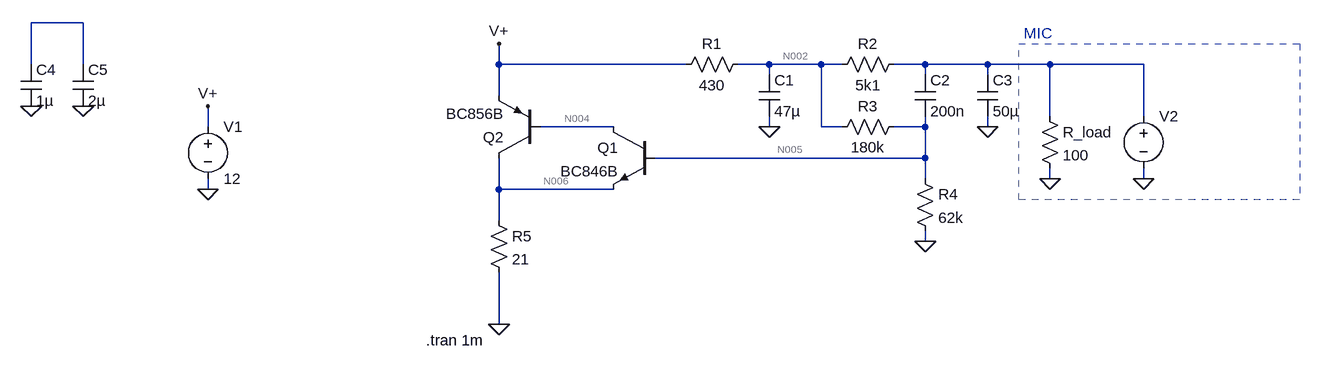
[diagram p0: schematic Draft1.asc]
Draft1.asc, the LTspice schematic file:
Version 4
SHEET 1 1544 696
WIRE -640 -64 -720 -64
WIRE -720 0 -720 -64
WIRE -640 0 -640 -64
WIRE 0 0 0 -32
WIRE 288 0 0 0
WIRE 416 0 368 0
WIRE 496 0 416 0
WIRE 528 0 496 0
WIRE 656 0 608 0
WIRE 752 0 656 0
WIRE 848 0 752 0
WIRE 992 0 848 0
WIRE 416 16 416 0
WIRE 656 16 656 0
WIRE 752 16 752 0
WIRE 0 48 0 0
WIRE 848 80 848 0
WIRE 992 80 992 0
WIRE -448 96 -448 64
WIRE 176 96 64 96
WIRE 416 96 416 80
WIRE 496 96 496 0
WIRE 528 96 496 96
WIRE 656 96 656 80
WIRE 656 96 608 96
WIRE 752 96 752 80
WIRE 656 144 656 96
WIRE 656 144 240 144
WIRE 656 176 656 144
WIRE 848 176 848 160
WIRE 992 176 992 160
WIRE -448 192 -448 176
WIRE 0 192 0 144
WIRE 176 192 0 192
WIRE 0 240 0 192
WIRE 656 272 656 256
WIRE 0 400 0 320
FLAG 0 -32 V+
FLAG 0 400 0
FLAG 416 96 0
FLAG 992 176 0
FLAG 656 272 0
FLAG -448 192 0
FLAG -448 64 V+
FLAG 848 176 0
FLAG 752 96 0
FLAG -720 64 0
FLAG -640 64 0
SYMBOL npn 240 96 M0
SYMATTR InstName Q1
SYMATTR Value BC846B
SYMBOL pnp 64 144 R180
SYMATTR InstName Q2
SYMATTR Value BC856B
SYMBOL res 272 16 R270
WINDOW 0 32 56 VTop 2
WINDOW 3 0 56 VBottom 2
SYMATTR InstName R1
SYMATTR Value 430
SYMBOL res 512 16 R270
WINDOW 0 32 56 VTop 2
WINDOW 3 0 56 VBottom 2
SYMATTR InstName R2
SYMATTR Value 5k1
SYMBOL cap 400 16 R0
SYMATTR InstName C1
SYMATTR Value 47µ
SYMATTR SpiceLine V=25
SYMBOL res 512 112 R270
WINDOW 0 32 56 VTop 2
WINDOW 3 0 56 VBottom 2
SYMATTR InstName R3
SYMATTR Value 180k
SYMBOL res 832 64 R0
SYMATTR InstName R_load
SYMATTR Value 100
SYMBOL cap 640 16 R0
SYMATTR InstName C2
SYMATTR Value 200n
SYMBOL res 640 160 R0
SYMATTR InstName R4
SYMATTR Value 62k
SYMBOL voltage -448 80 R0
WINDOW 123 0 0 Left 0
WINDOW 39 0 0 Left 0
SYMATTR InstName V1
SYMATTR Value 12
SYMBOL voltage 992 64 R0
WINDOW 123 0 0 Left 0
WINDOW 39 0 0 Left 0
SYMATTR InstName V2
SYMATTR Value ""
SYMBOL res -16 224 R0
SYMATTR InstName R5
SYMATTR Value 21
SYMBOL cap 736 16 R0
SYMATTR InstName C3
SYMATTR Value 50µ
SYMBOL cap -736 0 R0
SYMATTR InstName C4
SYMATTR Value 1µ
SYMATTR SpiceLine V=200
SYMBOL cap -656 0 R0
SYMATTR InstName C5
SYMATTR Value 2µ
SYMATTR SpiceLine V=200
TEXT 808 -48 Left 2 ;MIC
TEXT -112 424 Left 2 !.tran 1m
RECTANGLE Normal 1232 208 800 -32 2

The netlist it stands for:
* Draft1.asc
Q1 N004 N005 N006 0 BC846B
Q2 N006 N004 V+ 0 BC856B
R1 V+ N002 430
R2 N002 N003 5k1
C1 N002 0 47µ V=25
R3 N002 N005 180k
R_load N003 0 100
C2 N003 N005 200n
R4 N005 0 62k
V1 V+ 0 12
V2 N003 0
R5 N006 0 21
C3 N003 0 50µ
C4 N001 0 1µ V=200
C5 N001 0 2µ V=200
.model NPN NPN
.model PNP PNP
.lib standard.bjt
* MIC
.tran 1m
.backanno
.end

* Results of the author's LTspice run, read from the files saved beside the schematic
* Operating Point, zero values left out:
*   V(n004) = 11.16 V
*   V(n005) = 2.751 V
*   V(n006) = 2.13 V
*   V(v+) = 12 V
*   V(n002) = 11.05 V
*   Ic(Q2) = -100.8 mA
*   Ib(Q2) = -594 µA
*   Ie(Q2) = 101.4 mA
*   Ic(Q1) = 593.9 µA
*   Ib(Q1) = 1.73 µA
*   Ie(Q1) = -595.7 µA
*   I(R5) = 101.4 mA
*   I(R4) = 44.37 µA
*   I(R3) = 46.1 µA
*   I(R2) = 2.166 mA
*   I(R1) = 2.212 mA
*   I(V2) = 2.166 mA
*   I(V1) = -103.6 mA